# Altium schematic sheet adv_block.SchDoc
size A4
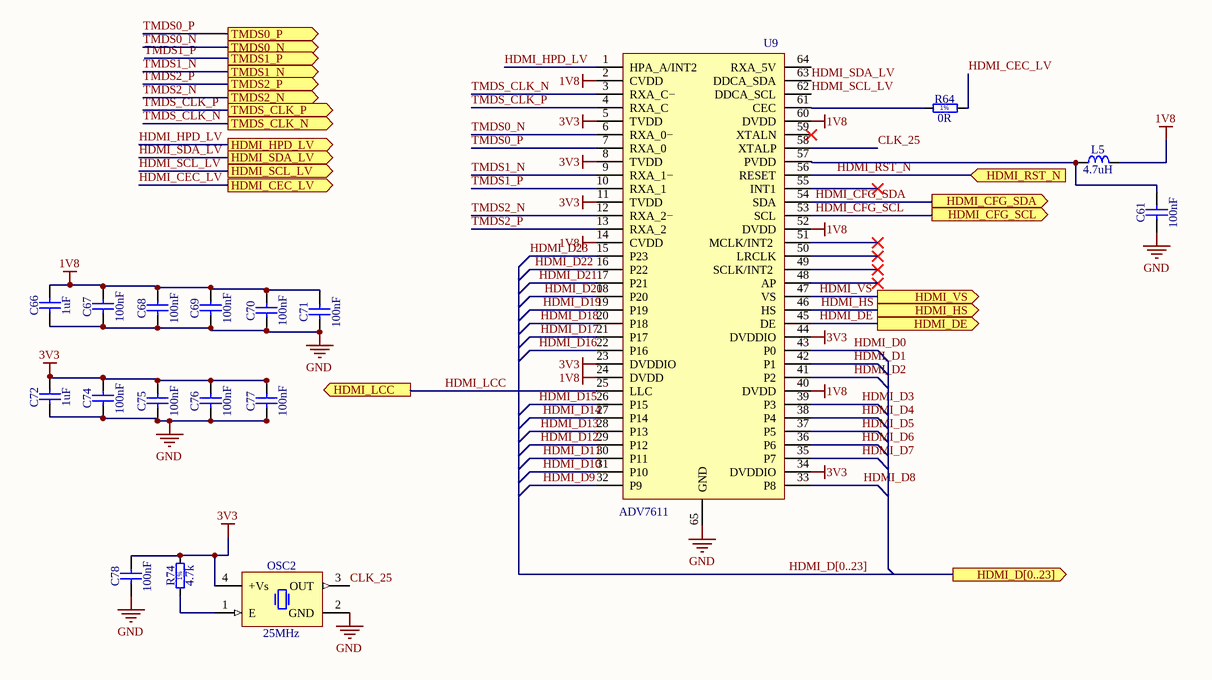
[diagram p0: adv_block.SchDoc]

## Parts
C61  100nF  [CAPC1005X55N]
C66  1uF  [CAPC1005X55N]
C67  100nF  [CAPC1005X55N]
C68  100nF  [CAPC1005X55N]
C69  100nF  [CAPC1005X55N]
C70  100nF  [CAPC1005X55N]
C71  100nF  [CAPC1005X55N]
C72  1uF  [CAPC1005X55N]
C74  100nF  [CAPC1005X55N]
C75  100nF  [CAPC1005X55N]
C76  100nF  [CAPC1005X55N]
C77  100nF  [CAPC1005X55N]
C78  100nF  [CAPC1005X55N]
L5  4.7uH  [IND_MURATA_BLM31PG]
OSC2  25MHz  [OSC_IQD_CFPS-69]
R64  0R  [RESC1005X40N]
R74  4.7k  [RESC1608X55N]
U9  ADV7611  [QFP50P1200X1200X120-65N-S415]

## Ports
HDMI_CEC_LV (out), HDMI_CFG_SCL (out), HDMI_CFG_SDA (out), HDMI_D[0..23] (out), HDMI_DE (out), HDMI_HPD_LV (out), HDMI_HS (out), HDMI_LCC (out), HDMI_RST_N (in), HDMI_SCL_LV (out), HDMI_SDA_LV (out), HDMI_VS (out), TMDS0_N (out), TMDS0_P (out), TMDS1_N (out), TMDS1_P (out), TMDS2_N (out), TMDS2_P (out), TMDS_CLK_N (out), TMDS_CLK_P (out)

## Nets
1V8: C66.2 C67.2 C68.2 C69.2 C70.2 C71.2 L5.2 U9.2(CVDD) U9.14(CVDD) U9.24(DVDD) U9.40(DVDD) U9.52(DVDD) U9.60(DVDD)
3V3: C72.2 C74.2 C75.2 C76.2 C77.2 C78.2 OSC2.4(+Vs) R74.2 U9.5(TVDD) U9.8(TVDD) U9.11(TVDD) U9.23(DVDDIO) U9.34(DVDDIO) U9.44(DVDDIO)
GND: C61.1 C66.1 C67.1 C68.1 C69.1 C70.1 C71.1 C72.1 C74.1 C75.1 C76.1 C77.1 C78.1 OSC2.2(GND) U9.65(GND)
CLK_25: OSC2.3(OUT) U9.58(XTALP)
HDMI_CEC_LV: R64.2 ; port HDMI_CEC_LV
HDMI_CFG_SCL: U9.53(SCL) ; port HDMI_CFG_SCL
HDMI_CFG_SDA: U9.54(SDA) ; port HDMI_CFG_SDA
HDMI_D0: U9.43(P0)
HDMI_D1: U9.42(P1)
HDMI_D2: U9.41(P2)
HDMI_D3: U9.39(P3)
HDMI_D4: U9.38(P4)
HDMI_D5: U9.37(P5)
HDMI_D6: U9.36(P6)
HDMI_D7: U9.35(P7)
HDMI_D8: U9.33(P8)
HDMI_D9: U9.32(P9)
HDMI_D10: U9.31(P10)
HDMI_D11: U9.30(P11)
HDMI_D12: U9.29(P12)
HDMI_D13: U9.28(P13)
HDMI_D14: U9.27(P14)
HDMI_D15: U9.26(P15)
HDMI_D16: U9.22(P16)
HDMI_D17: U9.21(P17)
HDMI_D18: U9.20(P18)
HDMI_D19: U9.19(P19)
HDMI_D20: U9.18(P20)
HDMI_D21: U9.17(P21)
HDMI_D22: U9.16(P22)
HDMI_D23: U9.15(P23)
HDMI_DE: U9.45(DE) ; port HDMI_DE
HDMI_HPD_LV: U9.1(HPA_A/INT2) ; port HDMI_HPD_LV
HDMI_HS: U9.46(HS) ; port HDMI_HS
HDMI_LCC: U9.25(LLC) ; port HDMI_LCC
HDMI_RST_N: U9.56(RESET) ; port HDMI_RST_N
HDMI_SCL_LV: U9.62(DDCA_SCL) ; port HDMI_SCL_LV
HDMI_SDA_LV: U9.63(DDCA_SDA) ; port HDMI_SDA_LV
HDMI_VS: U9.47(VS) ; port HDMI_VS
TMDS0_N: U9.6(RXA_0−) ; port TMDS0_N
TMDS0_P: U9.7(RXA_0) ; port TMDS0_P
TMDS1_N: U9.9(RXA_1−) ; port TMDS1_N
TMDS1_P: U9.10(RXA_1) ; port TMDS1_P
TMDS2_N: U9.12(RXA_2−) ; port TMDS2_N
TMDS2_P: U9.13(RXA_2) ; port TMDS2_P
TMDS_CLK_N: U9.3(RXA_C−) ; port TMDS_CLK_N
TMDS_CLK_P: U9.4(RXA_C) ; port TMDS_CLK_P
NetC61_2: C61.2 L5.1 U9.57(PVDD)
NetOSC2_1: OSC2.1(E) R74.1
NetR64_1: R64.1 U9.61(CEC)

Not connected (* = marked no-connect by the designer): U9 48(AP)* 49(SCLK/INT2_)* 50(LRCLK)* 51(MCLK/INT2_)* 55(INT1)* 59(XTALN)* 64(RXA_5V)

## Buses and harness runs
bus HDMI_D[0..23] = port HDMI_D[0..23]

## Notes on the sheet
- (in symbol R0402_10K_1%_0.0625W_100PPM) 1%
- (in symbol R0603_100K_1%_0.1W_100PPM) 1%

## Library data of the parts
C61 C67-C71 C74-C78 = CC0402_100NF_16V_10%_X5R: Non-polarised capacitor; Part Description: SMD Multilayer Chip Ceramic Capacitor; Manufacturer: GENERIC; Manufacturer1 Part Number: GRM155R61C104KA88D; Voltage: 16V; TC: X5R; Tolerance: ±10%; Part Number: CC0402_100NF_16V_10%_X5R; Component Kind: Standard; Component Type: Standard; Pin Count: 2; Value: 100nF; Status: None; Manufacturer Part Number: CC0402_100NF_16V_10%_X5R; Case: 0402; Mounted: Yes; Socket: No; SMD: Yes; Sense: No; Manufacturer1 Example: MURATA; Manufacturer1 ComponentHeight: 0.55mm; HelpURL: \\cern.ch\dfs\Applications\Altium\Datasheets\CC0402_X5R_MURATA_GRM.pdf; Author: CERN DEM JLC; CreateDate: 10.12.2013; LatestRevisionDate: 10.12.2013
C66 C72 = CC0402_100NF_16V_10%_X5R: Non-polarised capacitor; Part Description: SMD Multilayer Chip Ceramic Capacitor; Manufacturer: GENERIC; Manufacturer1 Part Number: GRM155R61C104KA88D; Value: 100nF; Voltage: 16V; TC: X5R; Tolerance: ±10%; Part Number: CC0402_100NF_16V_10%_X5R; Component Kind: Standard; Component Type: Standard; Pin Count: 2; Status: None; Manufacturer Part Number: CC0402_100NF_16V_10%_X5R; Case: 0402; Mounted: Yes; Socket: No; SMD: Yes; Sense: No; Manufacturer1 Example: MURATA; Manufacturer1 ComponentHeight: 0.55mm; HelpURL: \\cern.ch\dfs\Applications\Altium\Datasheets\CC0402_X5R_MURATA_GRM.pdf; Author: CERN DEM JLC; CreateDate: 10.12.2013; LatestRevisionDate: 10.12.2013
L5 = IND1206_MURATA_BLM31PG500SN1: Inductor; Part Description: SMD EMIFIL Chip Ferrite Bead; Manufacturer: MURATA; Value: 50R@100MHz; Power: 3.5A; Resistance: 0.015R; Part Number: IND1206_MURATA_BLM31PG500SN1; Component Kind: Standard; Component Type: Standard; Pin Count: 2; Status: None; Manufacturer Part Number: BLM31PG500SN1; Case: 1206; Mounted: Yes; Socket: No; SMD: Yes; Sense: No; ComponentHeight: 1.3mm; HelpURL: \\cern.ch\dfs\Applications\Altium\Datasheets\IND1206_MURATA_BLM31P.pdf; Author: CERN DEM JLC; CreateDate: 05.12.2013; LatestRevisionDate: 05.12.2013
OSC2 = OSC_50MHZ_IQD_LFSPXO009592: Oscillator 4 pins 1=E 2=GND 3=OUT 4=+Vs; Part Description: 3.3V, ±50ppm,  -40..85°C, CMOS Surface Mount Clock Oscillator, Low Current (CFPS-69 Series); Manufacturer: IQD FREQUENCY PRODUCTS; Value: 50MHz; PressFit: No; Bonding: No; Part Number: OSC_50MHZ_IQD_LFSPXO009592; Component Kind: Standard; Component Type: Standard; PackageDescription: Oscillator, Side Concave, 2.54mm Pitch, 4 Pins, 3.20mm L X 5.00mm W X 1.00mm H, CFPS-69 Series; Manufacturer Part Number: LFSPXO009592; Pin Count: 4; Mounted: Yes; Socket: No; SMD: Yes; Sense: No; ComponentHeight: 0.95mm; HelpURL: \\cern.ch\dfs\Applications\Altium\Datasheets\OSC_IQD_LFSPXO009592.pdf; Author: CERN DEM JLC; CreateDate: 16.03.2010; LatestRevisionDate: 07.11.2016
R64 = R0402_10K_1%_0.0625W_100PPM: Resistor - 1%; Part Description: General Purpose Thick Film Chip Resistor; Manufacturer: GENERIC; Manufacturer1 Part Number: 232270671003L; Value: 10k; TC: ±100ppm/°C; PressFit: No; Part Number: R0402_10K_1%_0.0625W_100PPM; Component Kind: Standard; Component Type: Standard; Pin Count: 2; Status: Not Recommended; Power: 0.0625W; Tolerance: ±1%; Manufacturer Part Number: R0402_10K_1%_0.0625W_100PPM; Case: 0402; Mounted: Yes; Sense: No; Socket: No; SMD: Yes; Manufacturer1 Example: YAGEO PHYCOMP; Manufacturer1 ComponentHeight: 0.4mm; HelpURL: \\cern.ch\dfs\Applications\Altium\Datasheets\R0402_Phycomp_RC0402.pdf; Author: CERN DEM JLC; CreateDate: 03.12.2007; LatestRevisionDate: 17.10.2012
R74 = R0603_100K_1%_0.1W_100PPM: Resistor - 1%; Part Description: General Purpose Thick Film Chip Resistor; Manufacturer: GENERIC; Manufacturer1 Part Number: NRC06F1003TRF; Value: 100k; Power: 0.1W; TC: ±100ppm/°C; PressFit: No; Part Number: R0603_100K_1%_0.1W_100PPM; Component Kind: Standard; Component Type: Standard; Pin Count: 2; Status: Preferred; Tolerance: ±1%; Manufacturer Part Number: R0603_100K_1%_0.1W_100PPM; Case: 0603; Mounted: Yes; Sense: No; Socket: No; SMD: Yes; Manufacturer1 Example: NIC COMPONENT; Manufacturer1 ComponentHeight: 0.55mm; HelpURL: \\cern.ch\dfs\Applications\Altium\Datasheets\R0603_NIC_NRC.pdf; Author: CERN DEM JLC; CreateDate: 03.12.2007; LatestRevisionDate: 13.03.2008
U9 = ADV7611: Low Power 165 MHz HDMI Receiver